# Altium project Vicor_DCDC.PrjPcb
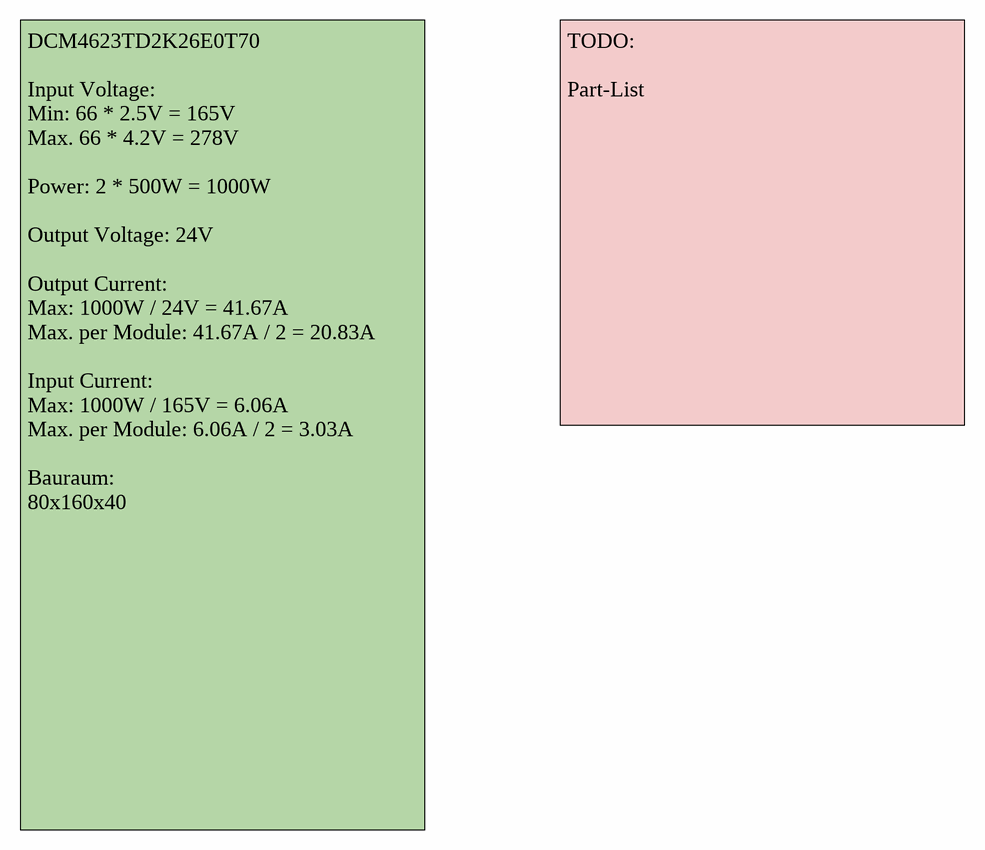
[diagram p0: Information.SchDoc]
BoardName: BOARDNAME TODO; BoardRevision: 1.0; Organization: Baltic Racing
3 sheets, 109 parts. Net scope: global (net labels, ports and power ports of the same name join across sheets).
Board file: Vicor_DCDC_PCB.PcbDoc
Sheets:
  Information.SchDoc
  Power_Circuitry.SchDoc
  CTRL_Circuitry.SchDoc

## Sheet Information.SchDoc: Information
size A3; Date: 05.10.2017; CheckedBy: Nico Bieberich; Author: Nico Bieberich; Organization: Baltic Racing; Address1: Zur Schwedenschanze 15; Address2: Haus 18; Address3: 18435 Stralsund; DocumentNumber: 3; Revision: xx.xx; SheetNumber: 1; SheetTotal: 3; Rules: TODO; ProjectName: Projekt

### Notes on the sheet
- TODO:
  Part-List
- DCM4623TD2K26E0T70
  Input Voltage:
  Min: 66 * 2.5V = 165V
  Max. 66 * 4.2V = 278V
  Power: 2 * 500W = 1000W
  Output Voltage: 24V
  Output Current:
  Max: 1000W / 24V = 41.67A
  Max. per Module: 41.67A / 2 = 20.83A
  Input Current:
  Max: 1000W / 165V = 6.06A
  Max. per Module: 6.06A / 2 = 3.03A
  Bauraum:
  80x160x40
- Title:
- Projekt:
- Revision:
- Author:
- Rules:
- Checked by:
- Sheet
- of
- Size:
- A4
- Date:
- Time:

## Sheet Power_Circuitry.SchDoc: Power Circuitry
size A3; CheckedBy: Nico Bieberich; Author: Nico Bieberich; Organization: Baltic Racing; Address1: Zur Schwedenschanze 15; Address2: Haus 18; Address3: 18435 Stralsund; DocumentNumber: 1; Revision: xx.xx; SheetNumber: 2; SheetTotal: 3; Rules: TODO; SPICEModelCacheZRUIZMAV: <root> / <DocumentId>ZRUIZMAV</DocumentId> / <CacheFrame Number="0"> / <Model Name="2220_885012214005_10uf" Kind="CKT"> / <Text>******* / .subckt 2220_885012214005_10uF 1 2 / Rser 1 3 0.003 / Lser 2 4 0.0000000012 / C1 3 4 0.00001 / Rpar 3 4 10000000 / .ends 2220_885012214005_10uF</Text> / </Model> / <Model Name="2220_885342214142_220nf" Kind="CKT"> / <Text>******* / .subckt 2220_885342214142_220nF 1 2 / Rser 1 3 0.0165 / Lser 2 4 0.000000001 / C1 3 4 0.00000022 / Rpar 3 4 500000000 / .ends 2220_885342214142_220nF</Text> / </Model> / <Model Name="1011_7843330056_0.56u" Kind="CKT"> / <Text>******* / .subckt 1011_7843330056_0.56u 1 2 / Rp 1 2 327.941 / Cp 1 2 4.14p / Rs 1 N3 0.0017 / L1 N3 2 0.611835u / .ends 1011_7843330056_0.56u</Text> / </Model> / </CacheFrame> / </root>; ProjectName: Projekt
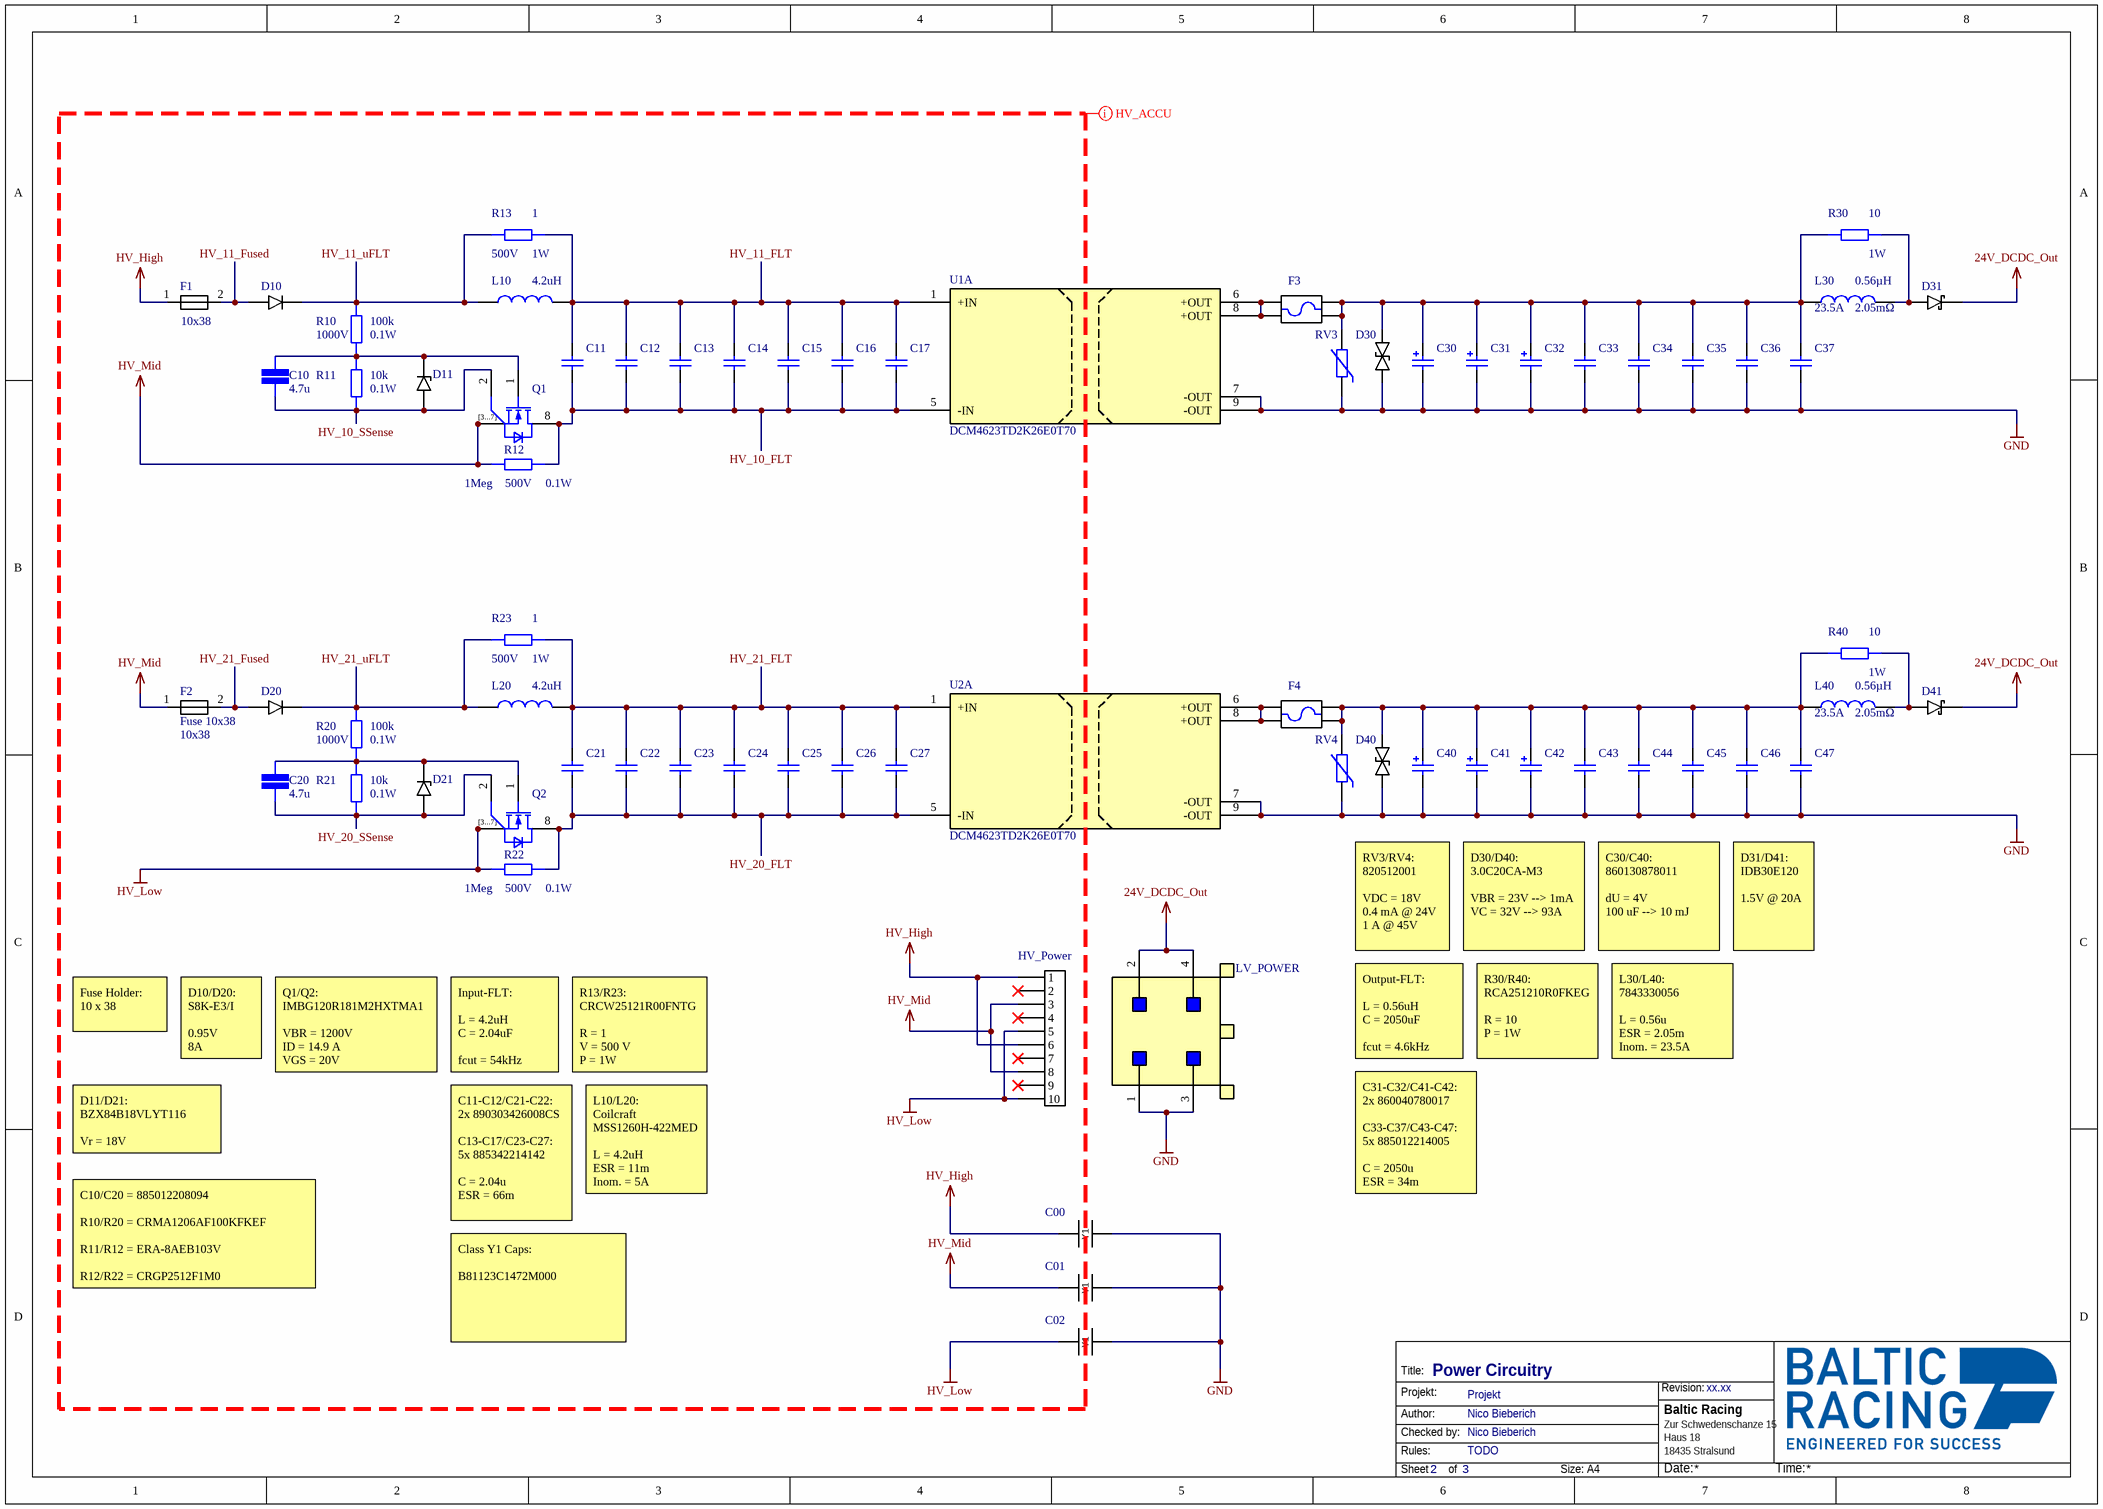
[diagram p1: Power_Circuitry.SchDoc]

### Parts
C00  B81123C1472M000  [B81123C1472M000]  (value not drawn)
C01  B81123C1472M000  [B81123C1472M000]  (value not drawn)
C02  B81123C1472M000  [B81123C1472M000]  (value not drawn)
C10  value 4.7u  [CAP 1206/3216]  (hidden comment: SMD Capacitor)
C11  630V DC, 0.47 uF  [WCAP-FTBE_26x9x18]  (value not drawn)
C12  630V DC, 0.47 uF  [WCAP-FTBE_26x9x18]  (value not drawn)
C13  220nF  [WCAP-CSMH_2220_L5.7W5H2]  (value not drawn)
C14  220nF  [WCAP-CSMH_2220_L5.7W5H2]  (value not drawn)
C15  220nF  [WCAP-CSMH_2220_L5.7W5H2]  (value not drawn)
C16  220nF  [WCAP-CSMH_2220_L5.7W5H2]  (value not drawn)
C17  220nF  [WCAP-CSMH_2220_L5.7W5H2]  (value not drawn)
C20  value 4.7u  [CAP 1206/3216]  (hidden comment: SMD Capacitor)
C21  630V DC, 0.47 uF  [WCAP-FTBE_26x9x18]  (value not drawn)
C22  630V DC, 0.47 uF  [WCAP-FTBE_26x9x18]  (value not drawn)
C23  220nF  [WCAP-CSMH_2220_L5.7W5H2]  (value not drawn)
C24  220nF  [WCAP-CSMH_2220_L5.7W5H2]  (value not drawn)
C25  220nF  [WCAP-CSMH_2220_L5.7W5H2]  (value not drawn)
C26  220nF  [WCAP-CSMH_2220_L5.7W5H2]  (value not drawn)
C27  220nF  [WCAP-CSMH_2220_L5.7W5H2]  (value not drawn)
C30  100uF, 100V  [WCAP-ATET_13x25]  (value not drawn)
C31  1000uF, 63V  [WCAP-ATUL_16x35.5]  (value not drawn)
C32  1000uF, 63V  [WCAP-ATUL_16x35.5]  (value not drawn)
C33  10uF  [WCAP-CSGP_2220_L5.7W5H2.8]  (value not drawn)
C34  10uF  [WCAP-CSGP_2220_L5.7W5H2.8]  (value not drawn)
C35  10uF  [WCAP-CSGP_2220_L5.7W5H2.8]  (value not drawn)
C36  10uF  [WCAP-CSGP_2220_L5.7W5H2.8]  (value not drawn)
C37  10uF  [WCAP-CSGP_2220_L5.7W5H2.8]  (value not drawn)
C40  100uF, 100V  [WCAP-ATET_13x25]  (value not drawn)
C41  1000uF, 63V  [WCAP-ATUL_16x35.5]  (value not drawn)
C42  1000uF, 63V  [WCAP-ATUL_16x35.5]  (value not drawn)
C43  10uF  [WCAP-CSGP_2220_L5.7W5H2.8]  (value not drawn)
C44  10uF  [WCAP-CSGP_2220_L5.7W5H2.8]  (value not drawn)
C45  10uF  [WCAP-CSGP_2220_L5.7W5H2.8]  (value not drawn)
C46  10uF  [WCAP-CSGP_2220_L5.7W5H2.8]  (value not drawn)
C47  10uF  [WCAP-CSGP_2220_L5.7W5H2.8]  (value not drawn)
D10  S8K-E3/I  [S8K-E3/I]  (value not drawn)
D11  BZX84B18VLYT116  [SOT-23-3]  (value not drawn)
D20  S8K-E3/I  [S8K-E3/I]  (value not drawn)
D21  BZX84B18VLYT116  [SOT-23-3]  (value not drawn)
D30  3.0C20CA-M3  [3.0C20CA-M3]  (value not drawn)
D31  IDB30E120  [Infineon IDB30E120]  (value not drawn)
D40  3.0C20CA-M3  [3.0C20CA-M3]  (value not drawn)
D41  IDB30E120  [Infineon IDB30E120]  (value not drawn)
F1  Format: 10x38  [Fuse Holder 10x38]  (hidden comment: Fuse 10x38)
F2  Fuse 10x38  Format: 10x38  [Fuse Holder 10x38]
F3  Keystone 3557-2  [Keystone 3557-2]  (value not drawn)
F4  Keystone 3557-2  [Keystone 3557-2]  (value not drawn)
HV_Power  43045-1012  [43045-1012]  (value not drawn)
L10  value 4.2uH  [Coilcraft MSS1260H-422MED]  (hidden comment: MSS1260H-422MED)
L20  value 4.2uH  [Coilcraft MSS1260H-422MED]  (hidden comment: MSS1260H-422MED)
L30  DC Resistance Max: 2.05mΩ  Inductance: 0.56µH  Rated Current: 23.5A  [WE-CHSA_1011]  (hidden comment: 0.56µH, 23.5A)
L40  DC Resistance Max: 2.05mΩ  Inductance: 0.56µH  Rated Current: 23.5A  [WE-CHSA_1011]  (hidden comment: 0.56µH, 23.5A)
LV_POWER  1720650004  [1720650004]  (value not drawn)
Q1  IMBG120R181M2H  [TO127P1500X470-8N-2-V1]  (value not drawn)
Q2  IMBG120R181M2H  [TO127P1500X470-8N-2-V1]  (value not drawn)
R10  value 100k  Voltage: 1000V  Power: 0.1W  [STACKPOLE CSR1206]  (hidden comment: SMD Resistor)
R11  value 10k  Power: 0.1W  [STACKPOLE CSR1206]  (hidden comment: SMD Resistor)
R12  value 1Meg  Voltage: 500V  Power: 0.1W  [STACKPOLE CSRN2512]  (hidden comment: SMD Resistor)
R13  value 1  Voltage: 500V  Power: 1W  [STACKPOLE CSRN2512]  (hidden comment: SMD Resistor)
R20  value 100k  Voltage: 1000V  Power: 0.1W  [STACKPOLE CSR1206]  (hidden comment: SMD Resistor)
R21  value 10k  Power: 0.1W  [STACKPOLE CSR1206]  (hidden comment: SMD Resistor)
R22  value 1Meg  Voltage: 500V  Power: 0.1W  [STACKPOLE CSRN2512]  (hidden comment: SMD Resistor)
R23  value 1  Voltage: 500V  Power: 1W  [STACKPOLE CSRN2512]  (hidden comment: SMD Resistor)
R30  value 10  Power: 1W  [STACKPOLE CSRN2512]  (hidden comment: SMD Resistor)
R40  value 10  Power: 1W  [STACKPOLE CSRN2512]  (hidden comment: SMD Resistor)
RV3  20VAC, 26VDC  [D12.5W5.1H15.5P0.8]  (value not drawn)
RV4  20VAC, 26VDC  [D12.5W5.1H15.5P0.8]  (value not drawn)
U1  Model: DCM4623TD2K26E0T70  [DCM4623]  (hidden comment: DCM4623)  (part A of 2)
U2  Model: DCM4623TD2K26E0T70  [DCM4623]  (hidden comment: DCM4623)  (part A of 2)

### Nets
24V_DCDC_Out: D31.2(C) D41.2(C) LV_POWER.2 LV_POWER.4
GND: C00.2 C01.2 C02.2 C30.1(N) C31.1(N) C32.1(N) C33.1 C34.1 C35.1 C36.1 C37.1 C40.1(N) C41.1(N) C42.1(N) C43.1 C44.1 C45.1 C46.1 C47.1 D30.1 D40.1 LV_POWER.1 LV_POWER.3 RV3.1 RV4.1 U1.7(-OUT) U1.9(-OUT) U2.7(-OUT) U2.9(-OUT)
HV_11_uFLT: D10.1(C) L10.1 R10.2 R13.2
HV_21_uFLT: D20.1(C) L20.1 R20.2 R23.2
HV_High: C00.1 F1.1 HV_Power.1 HV_Power.6
HV_Low: C02.1 HV_Power.5 HV_Power.10 Q2.3(SOURCE1) Q2.4(SOURCE2) Q2.5(SOURCE3) Q2.6(SOURCE4) Q2.7(SOURCE5) R22.2
HV_Mid: C01.1 F2.1 HV_Power.3 HV_Power.8 Q1.3(SOURCE1) Q1.4(SOURCE2) Q1.5(SOURCE3) Q1.6(SOURCE4) Q1.7(SOURCE5) R12.2
HV_10_FLT: C11.1 C12.1 C13.1 C14.1 C15.1 C16.1 C17.1 Q1.8(DRAIN) R12.1 U1.5(-IN)
HV_10_SSense: C10.1 D11.1(A) Q1.2(SENSE) R11.1
HV_11_FLT: C11.2 C12.2 C13.2 C14.2 C15.2 C16.2 C17.2 L10.2 R13.1 U1.1(+IN)
HV_11_Fused: D10.2(A) F1.2
HV_20_FLT: C21.1 C22.1 C23.1 C24.1 C25.1 C26.1 C27.1 Q2.8(DRAIN) R22.1 U2.5(-IN)
HV_20_SSense: C20.1 D21.1(A) Q2.2(SENSE) R21.1
HV_21_FLT: C21.2 C22.2 C23.2 C24.2 C25.2 C26.2 C27.2 L20.2 R23.1 U2.1(+IN)
HV_21_Fused: D20.2(A) F2.2
NetC10_2: C10.2 D11.3(C) Q1.1(GATE) R10.1 R11.2
NetC20_2: C20.2 D21.3(C) Q2.1(GATE) R20.1 R21.2
NetC30_2: C30.2(P) C31.2(P) C32.2(P) C33.2 C34.2 C35.2 C36.2 C37.2 D30.2 F3.O1 F3.O2 L30.1 R30.2 RV3.2
NetC40_2: C40.2(P) C41.2(P) C42.2(P) C43.2 C44.2 C45.2 C46.2 C47.2 D40.2 F4.O1 F4.O2 L40.1 R40.2 RV4.2
NetD31_3: D31.3(A) L30.2 R30.1
NetD41_3: D41.3(A) L40.2 R40.1
NetF3_I1: F3.I1 F3.I2 U1.6(+OUT) U1.8(+OUT)
NetF4_I1: F4.I1 F4.I2 U2.6(+OUT) U2.8(+OUT)

Not connected (* = marked no-connect by the designer): HV_Power 2* 4* 7* 9*

### Layout directives
net class HV_ACCU: HV_10_FLT, HV_10_SSense, HV_11_FLT, HV_11_Fused, HV_11_uFLT, HV_20_FLT, HV_20_SSense, HV_21_FLT, HV_21_Fused, HV_21_uFLT, HV_High, HV_Low, HV_Mid

### Notes on the sheet
- RV3/RV4:
  820512001
  VDC = 18V
  0.4 mA @ 24V
  1 A @ 45V
- D30/D40:
  3.0C20CA-M3
  VBR = 23V --> 1mA
  VC = 32V --> 93A
- C30/C40:
  860130878011
  dU = 4V
  100 uF --> 10 mJ
- D31/D41:
  IDB30E120
  1.5V @ 20A
- Fuse Holder:
  10 x 38
- D10/D20:
  S8K-E3/I
  0.95V
  8A
- Output-FLT:
  L = 0.56uH
  C = 2050uF
  fcut = 4.6kHz
- R30/R40:
  RCA251210R0FKEG
  R = 10
  P = 1W
- L30/L40:
  7843330056
  L = 0.56u
  ESR = 2.05m
  Inom. = 23.5A
- Q1/Q2:
  IMBG120R181M2HXTMA1
  VBR = 1200V
  ID = 14.9 A
  VGS = 20V
- Input-FLT:
  L = 4.2uH
  C = 2.04uF
  fcut = 54kHz
- R13/R23:
  CRCW25121R00FNTG
  R = 1
  V = 500 V
  P = 1W
- D11/D21:
  BZX84B18VLYT116
  Vr = 18V
- L10/L20:
  Coilcraft
  MSS1260H-422MED
  L = 4.2uH
  ESR = 11m
  Inom. = 5A
- C31-C32/C41-C42:
  2x 860040780017
  C33-C37/C43-C47:
  5x 885012214005
  C = 2050u
  ESR = 34m
- C11-C12/C21-C22:
  2x 890303426008CS
  C13-C17/C23-C27:
  5x 885342214142
  C = 2.04u
  ESR = 66m
- C10/C20 = 885012208094
  R10/R20 = CRMA1206AF100KFKEF
  R11/R12 = ERA-8AEB103V
  R12/R22 = CRGP2512F1M0
- Class Y1 Caps:
  B81123C1472M000
- Title:
- Projekt:
- Revision:
- Author:
- Rules:
- Checked by:
- Sheet
- of
- Size:
- A4
- Date:
- Time:
- (in symbol IMBG120R181M2H) [3...7]

### Library data of the parts
C00 C01 C02 = B81123C1472M000: EPCOS/TDK B81123C1472M000 / Class Y1 Capacitor; Capacitance: 4.7 nF; DC Voltage: 3 kV; AC Voltage: 500 VAC; Safety Class: Y1
C10 C20 = SMD Capacitor: Capacitor with multiple Footprints; Voltage: 32V
C11 C12 C21 C22 = 890303426008CS: WCAP-FTBE Film Capacitors, 26x9x18mm, 630V DC, 0.47 uF; Rated Voltage: 630V DC; Value: 0.47 uF; ComponentLink1Description: Manufacturer; ComponentLink1URL: http://www.we-online.de; ComponentLink2Description: Datasheet; ComponentLink2URL: http://katalog.we-online.de/pbs/datasheet/890303426008CS.pdf; Part Number: 890303426008CS; Published Date: Sep. 2017; Publisher: Wurth Elektronik; Size: 26x9x18mm; Operating Temperature: -40 °C to +85 °C
C13-C17 C23-C27 = 885342214142: WCAP-CSMH Multilayer Ceramic Chip Capacitor, Mid and High Voltage, size 2220, X7R Class II, 220nF, 630VDC; Manufacturer: Wurth Elektronik; Case/Size Code: 2220; Capacitance Tolerance: 10%; Dissipation Factor: 2.5%; Insulation Resistance: 0.5GΩ; Rated Voltage (DC): 630V; Technical Reference: X7R2220224K630DFCT10000; Manufacturer Part Number: 885342214142; Category: Multilayer Ceramic Chip Capacitors; Match Code: WCAP-CSMH; ComponentLink1Description: Website Link; ComponentLink1URL: https://www.we-online.com/redexpert/article/885342214142?ad; ComponentLink2Description: Datasheet Link; ComponentLink2URL: https://www.we-online.com/redexpert/spec/885342214142?ad; Mount: Surface Mount; Operating Temperature Max: 125°C; Operating Temperature Min: -55°C; Packaging: Tape and Reel; Length: 5.7mm; Width: 5mm; Height: 2mm; Capacitance: 220nF; Ceramic Type: X7R Class II
C30 C40 = 860130878011: WCAP-ATET THT Aluminum Electrolytic Capacitors, D13mm x L25mm, 100uF, +/-20%, 100VDC; Dissipation Factor: 7%; Endurance: 3000h; Leakage Current: 100uA; Ripple Current max.: 270mA; Technical Reference: ATGI250101M100DSPACC000; ComponentLink1Description: Manufacturer; ComponentLink1URL: http://www.we-online.de; ComponentLink2Description: Datasheet; ComponentLink2URL: https://katalog.we-online.com/pbs/datasheet/860130878011.pdf; Length: 25mm; Mounting Technology: THT; Operating Temperature: -40 to +125degC; Packaging: Ammo Pack; Published Date: August 2019; Capacitance: 100uF; Diameter: 13mm; Part Number: 860130878011; Publisher: Wurth Elektronik; Capacitance Tolerance: +/-20%; Rated Voltage: 100VDC
C31 C32 C41 C42 = 860040780017: WCAP-ATUL THT Aluminum Electrolytic Capacitors, D16mm x L35.5mm, 1000uF, +/-20%, 63VDC; Dissipation Factor: 9%; Endurance: 10000h; Leakage Current: 630uA; Ripple Current max.: 2500mA; Technical Reference: ATDK355102M063DSPADK000; ComponentLink1Description: Manufacturer; ComponentLink1URL: http://www.we-online.de; ComponentLink2Description: Datasheet; ComponentLink2URL: https://katalog.we-online.com/pbs/datasheet/860040780017.pdf; Length: 35.5mm; Mounting Technology: THT; Operating Temperature: -40 to +105degC; Packaging: Ammo Pack; Published Date: August 2019; Capacitance: 1000uF; Diameter: 16mm; Part Number: 860040780017; Publisher: Wurth Elektronik; Capacitance Tolerance: +/-20%; Rated Voltage: 63VDC
C33-C37 C43-C47 = 885012214005: WCAP-CSGP Multilayer Ceramic Chip Capacitor, General Purpose, size 2220, X7R Class II, 10uF, 50VDC; Manufacturer: Wurth Elektronik; Case/Size Code: 2220; Capacitance Tolerance: +/-10%; Dissipation Factor: 2.5%; Insulation Resistance: 0.01GOhm; Rated Voltage (DC): 50V; Technical Reference: X7R2220106K050DFCT10000; Manufacturer Part Number: 885012214005; Category: Multilayer Ceramic Chip Capacitors; Match Code: WCAP-CSGP; ComponentLink1Description: Website Link; ComponentLink1URL: https://www.we-online.com/redexpert/article/885012214005?ad; ComponentLink2Description: Datasheet Link; ComponentLink2URL: https://www.we-online.com/redexpert/spec/885012214005?ad; Mount: Surface Mount; Operating Temperature Max: 125°C; Operating Temperature Min: -55°C; Packaging: Tape and Reel; Length: 5.7mm; Width: 5mm; Height: 2.8mm; Capacitance: 10uF; Ceramic Type: X7R Class II
D10 D20 = S8K-E3/I: Vishay S8K-E3/I / Diode, 950mV, 8A, 800V; Vf: 0.95V; ComponentLink1Description: Octopart; ComponentLink1URL: https://octopart.com/s8k-e3%2Fi-vishay+semiconductor-137406611?r=sp
D11 D21 = BZX84B18VLYT116: ROHM BZX84B18VLYT116 / Z-Diode, 18V; Vr: 18V; ComponentLink1Description: Octopart; ComponentLink1URL: https://octopart.com/bzx84b18vlyt116-rohm-111546287?r=sp
D30 D40 = 3.0C20CA-M3: Vishay 3.0C20CA-M3 / Bidirect. TVS, 20V, 3kW; ComponentLink1Description: Octopart; ComponentLink1URL: https://octopart.com/3.0c20ca-m3%2Fh-vishay-133857999?r=sp
D31 D41 = IDB30E120: Infineon IDB30E120 / 1200V, 30A @ 1.7V; ComponentLink1Description: Octopart; ComponentLink1URL: https://octopart.com/idb30e120atma1-infineon-21386241?r=sp; Vf: 1.7V
F3 F4 = Keystone 3557-2: Keystone 3557-2 / Fuse Holder; ComponentLink1Description: Octopart; ComponentLink1URL: https://octopart.com/3557-2-keystone-850400?r=sp
HV_Power = 43045-1012: Micro-Fit 3.0 Vertical Header, 3.00mm Pitch, Dual Row, 10 Circuits, with PCB Polarizing Peg, Tin, Glow-Wire Capable, Black
L10 L20 = MSS1260H-422MED: Coilcraft MSS1260H-422MED / Shielded Inductor, 4.2uH, 11mOhm, 5A; DCR: 11m; ComponentLink1Description: Octopart; ComponentLink1URL: https://octopart.com/mss1260h-422med-coilcraft-119644693?r=sp; Irms: 5A
L30 L40 = 7843330056: WE-CHSA SMT High Current Inductor, size 1011, 0.56µH, 23.5A, 2.05mΩ; Manufacturer: Wurth Elektronik; Case/Size Code: 1011; DC Resistance: 1.7mΩ; Inductance Tolerance: 20%; Saturation Current: 43.4A; Self Resonant Frequency: 100MHz; Manufacturer Part Number: 7843330056; Category: Single Coil Power Inductors; Match Code: WE-CHSA; ComponentLink1Description: Website Link; ComponentLink1URL: https://www.we-online.com/redexpert/article/7843330056?ad; ComponentLink2Description: Datasheet Link; ComponentLink2URL: https://www.we-online.com/redexpert/spec/7843330056?ad; Mount: Surface Mount; Operating Temperature Max: 150°C; Operating Temperature Min: -55°C; Packaging: Tape and Reel; Length: 10.6mm; Width: 10.6mm; Height: 11mm; Automotive: Yes
LV_POWER = 1720650004: Molex Mega-Fit Vertical Header, Through Hole, 5.70mm Pitch, Dual Row, 4 Circuits, 0.38µm Gold (Au) Plating, Glow-Wire Capable, Black
Q1 Q2 = IMBG120R181M2H: Infineon IMBG120R181M2HXTMA1 / CoolSiC, 1200V, 15A, 181.4mOhm; ComponentLink1Description: Octopart; ComponentLink1URL: https://octopart.com/imbg120r181m2hxtma1-infineon-143244067?r=sp; Package Reference: PG-TO263-7-12
R10 R12 R13 R20 R22 R23 R30 R40 = SMD Resistor: Resistor with multiple footprints
R11 R21 = SMD Resistor: Resistor with multiple footprints; Voltage: 1000V
RV3 RV4 = 820512001: WE-VD Disk Varistor, THT, 20VAC, 26VDC, 4250pF; Manufacturer: Wurth Elektronik; Clamping Voltage: 65V; Energy Absorption: 4.4J; Operating Voltage (AC): 20V; Operating Voltage (DC): 26V; Pitch: 0.8mm; Power Dissipation: 0.05W; (Reverse) Breakdown Voltage: 33V; (Reverse) Peak Pulse Current: 500A; Manufacturer Part Number: 820512001; Category: Surge Protection; Match Code: WE-VD; ComponentLink1Description: Website Link; ComponentLink1URL: https://www.we-online.com/redexpert/article/820512001?ad; ComponentLink2Description: Datasheet Link; ComponentLink2URL: https://www.we-online.com/redexpert/spec/820512001?ad; Mount: Through Hole; Operating Temperature Max: 85°C; Operating Temperature Min: -40°C; Packaging: Tape and Reel; Width: 5.1mm; Height: 15.5mm; Diameter: 12.5mm; Channel Input Capacitance: 4250pF
U1 U2 = DCM4623: VICOR DCM® DC-DC Converter Module; ComponentLink1Description: VICOR; ComponentLink1URL: https://www.vicorpower.com/dc-dc/isolated-regulated/dcm
F1 F2 = Fuse 10x38: Voltage: *; Current: *

## Sheet CTRL_Circuitry.SchDoc: Control Circuitry
size A3; CheckedBy: Nico Bieberich; Author: Nico Bieberich; Organization: Baltic Racing; Address1: Zur Schwedenschanze 15; Address2: Haus 18; Address3: 18435 Stralsund; DocumentNumber: 2; Revision: xx.xx; SheetNumber: 3; SheetTotal: 3; Rules: TODO; SPICEModelCacheROTCYYSS: <root> / <DocumentId>ROTCYYSS</DocumentId> / <CacheFrame Number="0"> / <Model Name="0603_782631131_120ohm" Kind="CKT"> / <Text>******* / .subckt 0603_782631131_120ohm 1 2 / Rp 1 2 172 / Cp 1 2 0.545p / Rs 1 N3 0.12 / L1 N3 2 0.37u / .ends 0603_782631131_120ohm</Text> / </Model> / </CacheFrame> / </root>; ProjectName: Projekt
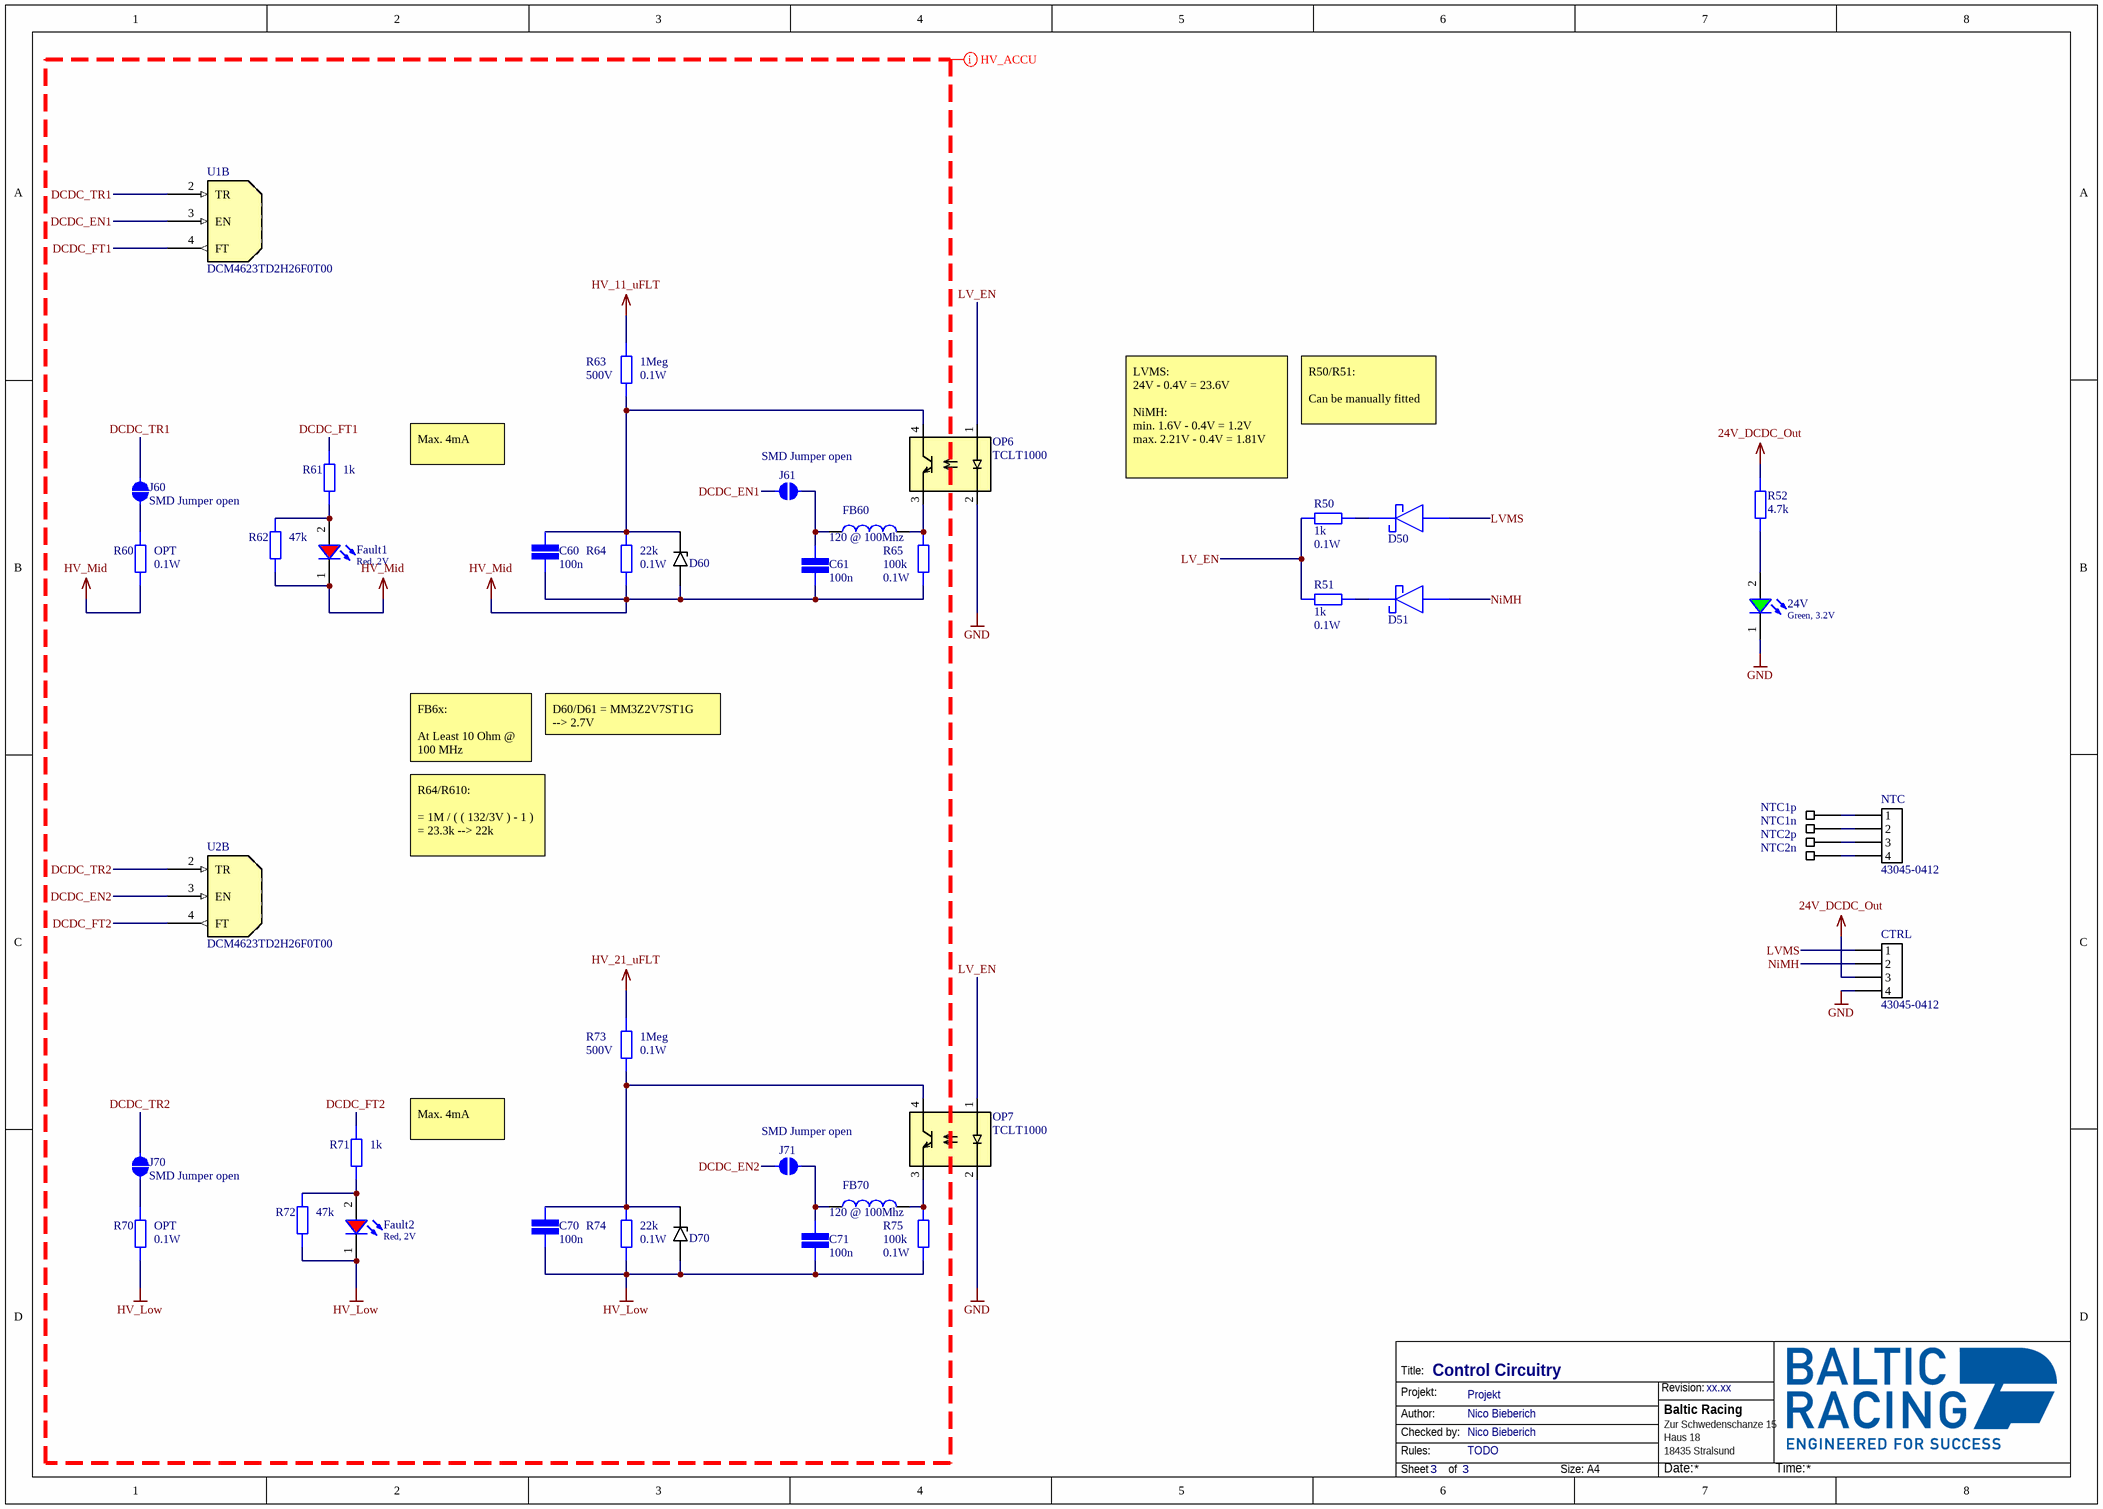
[diagram p2: CTRL_Circuitry.SchDoc]

### Parts
24V  Green, 3.2V  [WL-SMCW_0603_H=0.7mm]
C60  value 100n  [CAP 0603/1608]  (hidden comment: SMD Capacitor)
C61  value 100n  [CAP 0603/1608]  (hidden comment: SMD Capacitor)
C70  value 100n  [CAP 0603/1608]  (hidden comment: SMD Capacitor)
C71  value 100n  [CAP 0603/1608]  (hidden comment: SMD Capacitor)
CTRL  43045-0412  [43045-0412]
D50  CUS521,H3F  [SOD-323-2]  (value not drawn)
D51  CUS521,H3F  [SOD-323-2]  (value not drawn)
D60  MM3Z2V7ST1G  [SOD-323-2]  (value not drawn)
D70  MM3Z2V7ST1G  [SOD-323-2]  (value not drawn)
Fault1  Red, 2V  [WL-SMCW_0603_H=0.7mm]
Fault2  Red, 2V  [WL-SMCW_0603_H=0.7mm]
FB60  120 @ 100Mhz  [WE-CBA_0603_L1.6W0.8H0.8_HF/HS/WB]
FB70  120 @ 100Mhz  [WE-CBA_0603_L1.6W0.8H0.8_HF/HS/WB]
J60  SMD Jumper open  [SMD-JUMPER-OPEN]  (no BOM)
J61  SMD Jumper open  [SMD-JUMPER-OPEN]  (no BOM)
J70  SMD Jumper open  [SMD-JUMPER-OPEN]  (no BOM)
J71  SMD Jumper open  [SMD-JUMPER-OPEN]  (no BOM)
NTC  43045-0412  [43045-0412]
NTC1n  Pad  [Generic_Pad_1.5x1.5]  (value not drawn)
NTC1p  Pad  [Generic_Pad_1.5x1.5]  (value not drawn)
NTC2n  Pad  [Generic_Pad_1.5x1.5]  (value not drawn)
NTC2p  Pad  [Generic_Pad_1.5x1.5]  (value not drawn)
OP6  TCLT1000  [SOP-4L]
OP7  TCLT1000  [SOP-4L]
R50  value 1k  Power: 0.1W  [STACKPOLE CSR0603]  (hidden comment: SMD Resistor)
R51  value 1k  Power: 0.1W  [STACKPOLE CSR0603]  (hidden comment: SMD Resistor)
R52  value 4.7k  [STACKPOLE CSR0603]  (hidden comment: SMD Resistor)
R60  value OPT  Power: 0.1W  [STACKPOLE CSR0603]  (hidden comment: SMD Resistor)
R61  value 1k  [STACKPOLE CSR0603]  (hidden comment: SMD Resistor)
R62  value 47k  [STACKPOLE CSR0603]  (hidden comment: SMD Resistor)
R63  value 1Meg  Voltage: 500V  Power: 0.1W  [STACKPOLE CSRN2512]  (hidden comment: SMD Resistor)
R64  value 22k  Power: 0.1W  [STACKPOLE CSR0603]  (hidden comment: SMD Resistor)
R65  value 100k  Power: 0.1W  [STACKPOLE CSR0603]  (hidden comment: SMD Resistor)
R70  value OPT  Power: 0.1W  [STACKPOLE CSR0603]  (hidden comment: SMD Resistor)
R71  value 1k  [STACKPOLE CSR0603]  (hidden comment: SMD Resistor)
R72  value 47k  [STACKPOLE CSR0603]  (hidden comment: SMD Resistor)
R73  value 1Meg  Voltage: 500V  Power: 0.1W  [STACKPOLE CSRN2512]  (hidden comment: SMD Resistor)
R74  value 22k  Power: 0.1W  [STACKPOLE CSR0603]  (hidden comment: SMD Resistor)
R75  value 100k  Power: 0.1W  [STACKPOLE CSR0603]  (hidden comment: SMD Resistor)
U1  Model: DCM4623TD2H26F0T00  [DCM4623]  (hidden comment: DCM4623)  (part B of 2)
U2  Model: DCM4623TD2H26F0T00  [DCM4623]  (hidden comment: DCM4623)  (part B of 2)

### Nets
24V_DCDC_Out: CTRL.3 R52.2
GND: 24V.1(K) CTRL.4 OP6.2(DC) OP7.2(DC)
HV_11_uFLT: R63.2
HV_21_uFLT: R73.2
HV_Low: C70.1 C71.1 D70.2A(A) Fault2.1(K) R70.1 R72.1 R74.1 R75.1
HV_Mid: C60.1 C61.1 D60.2A(A) Fault1.1(K) R60.1 R62.1 R64.1 R65.1
DCDC_EN1: J61.2 U1.3(EN)
DCDC_EN2: J71.2 U2.3(EN)
DCDC_FT1: R61.2 U1.4(FT)
DCDC_FT2: R71.2 U2.4(FT)
DCDC_TR1: J60.2 U1.2(TR)
DCDC_TR2: J70.2 U2.2(TR)
LV_EN: OP6.1(DA) OP7.1(DA) R50.2 R51.2
LVMS: CTRL.1 D50.2A(A)
NiMH: CTRL.2 D51.2A(A)
Net24V_2: 24V.2(A) R52.1
NetC60_2: C60.2 D60.1C(C) OP6.4(TC) R63.1 R64.2
NetC61_2: C61.2 FB60.1 J61.1
NetC70_2: C70.2 D70.1C(C) OP7.4(TC) R73.1 R74.2
NetC71_2: C71.2 FB70.1 J71.1
NetD50_1C: D50.1C(C) R50.1
NetD51_1C: D51.1C(C) R51.1
NetFault1_2: Fault1.2(A) R61.1 R62.2
NetFault2_2: Fault2.2(A) R71.1 R72.2
NetFB60_2: FB60.2 OP6.3(TE) R65.2
NetFB70_2: FB70.2 OP7.3(TE) R75.2
NetJ60_1: J60.1 R60.2
NetJ70_1: J70.1 R70.2
NetNTC_1: NTC.1 NTC1p.P(Pad)
NetNTC_2: NTC.2 NTC1n.P(Pad)
NetNTC_3: NTC.3 NTC2p.P(Pad)
NetNTC_4: NTC.4 NTC2n.P(Pad)

### Layout directives
net class HV_ACCU: DCDC_EN1, DCDC_EN2, DCDC_FT1, DCDC_FT2, DCDC_TR1, DCDC_TR2, HV_11_uFLT, HV_21_uFLT, HV_Low, HV_Mid

### Notes on the sheet
- R50/R51:
  Can be manually fitted
- Max. 4mA
- (near R50) LVMS:
  24V - 0.4V = 23.6V
  NiMH:
  min. 1.6V - 0.4V = 1.2V
  max. 2.21V - 0.4V = 1.81V
- FB6x:
  At Least 10 Ohm @ 100 MHz
- D60/D61 = MM3Z2V7ST1G
  --> 2.7V
- R64/R610:
  = 1M / ( ( 132/3V ) - 1 )
  = 23.3k --> 22k
- Title:
- Projekt:
- Revision:
- Author:
- Rules:
- Checked by:
- Sheet
- of
- Size:
- A4
- Date:
- Time:

### Library data of the parts
24V = 150060GS75000: WL-SMCW SMT Mono-color Chip LED Waterclear, size 0603, Green, 3.2V, 140deg; Chip Technology: InGaN; Dominant Wavelength typ.: 525nm; Luminous Intensity typ.: 430mcd; Peak Wavelength typ.: 515nm; Viewing Angle: 140deg; ComponentLink1Description: Manufacturer; ComponentLink1URL: http://www.we-online.de; ComponentLink2URL: https://www.we-online.com/catalog/datasheet/150060GS75000.pdf; ComponentLink2Description: Datasheet; Forward Voltage typ.: 3.2V; Emitting Color: Green; Mounting Technology: SMT; Operating Temperature: -40 to +85degC; Published Date: December 2019; Part Number: 150060GS75000; Packaging: Tape and Reel; Size: 0603; Publisher: Wurth Elektronik
C60 C61 C70 C71 = SMD Capacitor: Capacitor with multiple Footprints; Voltage: *
CTRL NTC = 43045-0412: Micro-Fit 3.0 Vertical Header, 3.00mm Pitch, Dual Row, 4 Circuits, with PCB Polarizing Peg, Tin, Glow-Wire Capable, Black
D50 D51 = CUS521,H3F: Toshiba CUS521,H3F / Shottky-Diode / Forward: 390mV, Reverse: 30V; ComponentLink1Description: Octopart; ComponentLink1URL: https://octopart.com/cus521%2Ch3f-toshiba-26712463?r=sp
D60 D70 = MM3Z2V7ST1G: onsemi MM3Z2V7ST1G / Z-Diode, 2,7V; ComponentLink1Description: Octopart; ComponentLink1URL: https://octopart.com/mm3z4v7t1g-onsemi-331144?r=sp
Fault1 Fault2 = 150060RS75000: WL-SMCW SMT Mono-color Chip LED Waterclear, size 0603, Red, 2V, 140deg; Chip Technology: AlInGaP; Dominant Wavelength typ.: 625nm; Luminous Intensity typ.: 250mcd; Peak Wavelength typ.: 630nm; Viewing Angle: 140deg; ComponentLink1Description: Manufacturer; ComponentLink1URL: http://www.we-online.de; ComponentLink2URL: https://www.we-online.com/catalog/datasheet/150060RS75000.pdf; ComponentLink2Description: Datasheet; Forward Voltage typ.: 2V; Emitting Color: Red; Mounting Technology: SMT; Operating Temperature: -40 to +85degC; Published Date: December 2019; Part Number: 150060RS75000; Packaging: Tape and Reel; Size: 0603; Publisher: Wurth Elektronik
FB60 FB70 = 782631131: WE-CBA SMT EMI Suppression Ferrite Bead, size 0603, 120Ohm, 0.5A; Manufacturer: Wurth Elektronik; Case/Size Code: 0603; DC Resistance Max: 0.12Ohm; Impedance Max: 200Ohm; Type: Wide Band; Manufacturer Part Number: 782631131; Category: Ferrites for PCB Assembly; Match Code: WE-CBA; ComponentLink1Description: Website Link; ComponentLink1URL: https://www.we-online.com/redexpert/article/782631131?ad; ComponentLink2Description: Datasheet Link; ComponentLink2URL: https://www.we-online.com/redexpert/spec/782631131?ad; Mount: Surface Mount; Operating Temperature Max: 125°C; Operating Temperature Min: -55°C; Packaging: Tape and Reel; Length: 1.6mm; Width: 0.8mm; Height: 0.8mm; Automotive: Yes; Impedance @100MHz: 120Ohm; Rated Current: 0.5A
NTC1n NTC1p NTC2n NTC2p = Generic_Pad_1.5x1.5: Pad 1.5mm x 1.5mm
OP6 OP7 = TCLT1000: Opto-Isolator / Vishay TLCT100 series / 600V, 5mA, V_ISO= 5 kV (RMS); ComponentLink1Description: Octopart; ComponentLink1URL: https://octopart.com/tclt1000-vishay-55401777?r=sp
R50 R51 R60 R63-R65 R70 R73-R75 = SMD Resistor: Resistor with multiple footprints
R52 = SMD Resistor: Resistor with multiple footprints; Power: 0.1 W
R61 R62 R71 R72 = SMD Resistor: Resistor with multiple footprints; Power: 0.1W
U1 U2 = DCM4623: VICOR DCM® DC-DC Converter Module; ComponentLink1Description: VICOR; ComponentLink1URL: https://www.vicorpower.com/dc-dc/isolated-regulated/dcm

## Nets that join several sheets
24V_DCDC_Out: Power_Circuitry (D31.2 D41.2 LV_POWER.2 LV_POWER.4), CTRL_Circuitry (CTRL.3 R52.2)
GND: Power_Circuitry (29 pins), CTRL_Circuitry (24V.1 CTRL.4 OP6.2 OP7.2)
HV_11_uFLT: Power_Circuitry (D10.1 L10.1 R10.2 R13.2), CTRL_Circuitry (R63.2)
HV_21_uFLT: Power_Circuitry (D20.1 L20.1 R20.2 R23.2), CTRL_Circuitry (R73.2)
HV_Low: Power_Circuitry (9 pins), CTRL_Circuitry (8 pins)
HV_Mid: Power_Circuitry (10 pins), CTRL_Circuitry (8 pins)